# Altium schematic sheet Register.SchDoc
size B; Author: E. Sims; Organization: Let's Build Rockets Inc.; SheetNumber: 1; SheetTotal: 3
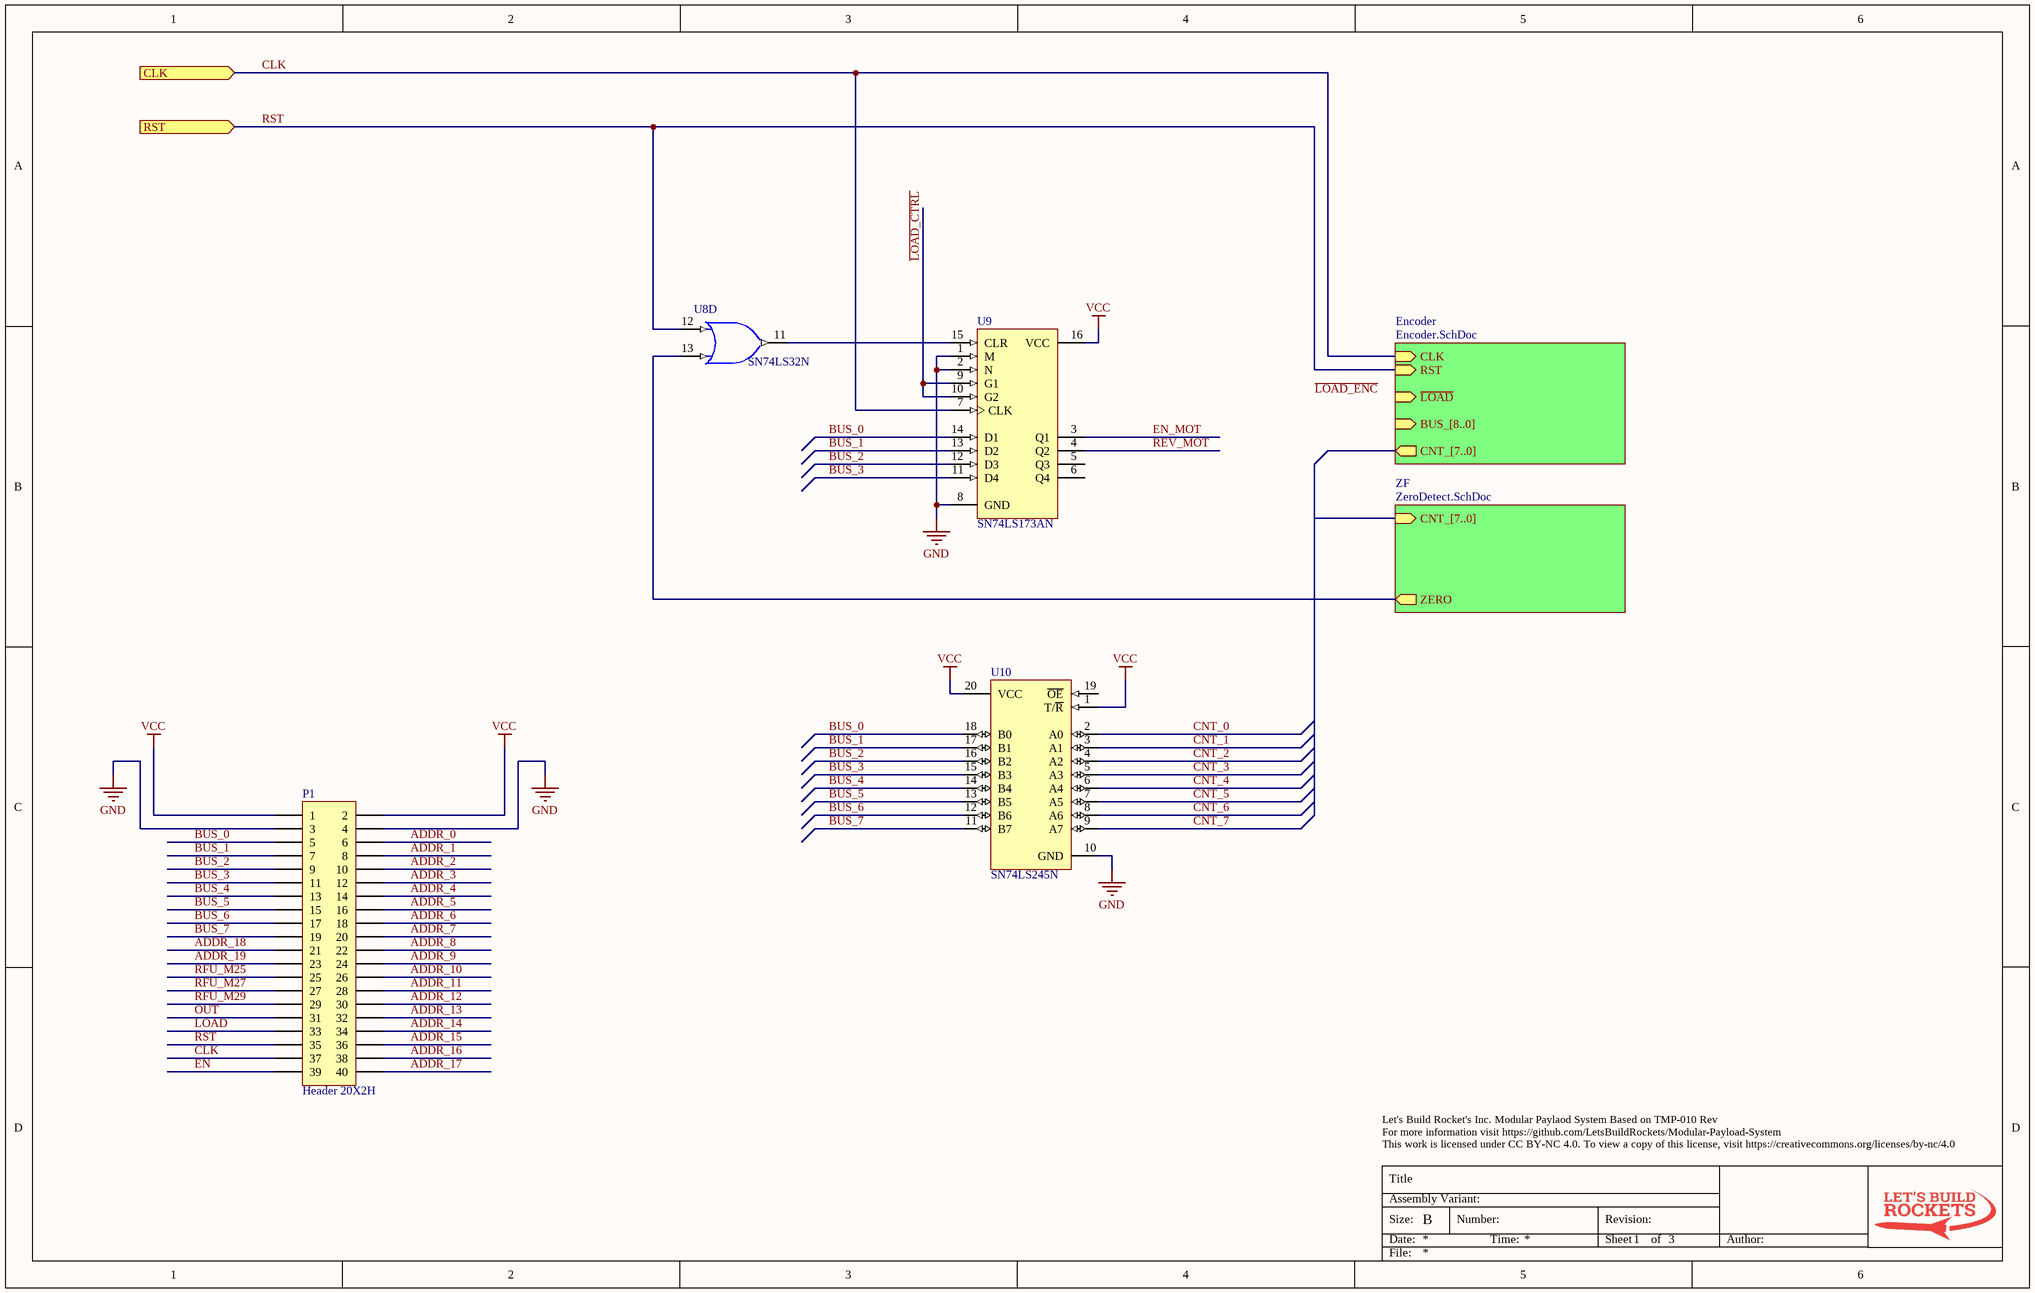
[diagram p0: Register.SchDoc]

## Parts
P1  Header 20X2H  [HDR2X20H]
U8  SN74LS32N  [N014]  (part D of 4)
U9  SN74LS173AN  [N016D]
U10  SN74LS245N  [N020]

## Sub-sheets
Encoder = Encoder.SchDoc: CNT_[7..0] (out), CLK (in), RST (in), BUS_[8..0] (in), ~{LOAD} (in)
ZF = ZeroDetect.SchDoc: CNT_[7..0] (in), ZERO (out)

## Ports
CLK (in), RST (in)

## Nets
GND: P1.3 P1.4 U8.7(GND) U9.1(M) U9.2(N) U9.8(GND) U10.10(GND)
VCC: P1.1 P1.2 U8.14(VCC) U9.16(VCC) U10.1(T/~{R}) U10.20(VCC)
ADDR_0: P1.6
ADDR_1: P1.8
ADDR_2: P1.10
ADDR_3: P1.12
ADDR_4: P1.14
ADDR_5: P1.16
ADDR_6: P1.18
ADDR_7: P1.20
ADDR_8: P1.22
ADDR_9: P1.24
ADDR_10: P1.26
ADDR_11: P1.28
ADDR_12: P1.30
ADDR_13: P1.32
ADDR_14: P1.34
ADDR_15: P1.36
ADDR_16: P1.38
ADDR_17: P1.40
ADDR_18: P1.21
ADDR_19: P1.23
BUS_0: P1.5 U9.14(D1) U10.18(B0)
BUS_1: P1.7 U9.13(D2) U10.17(B1)
BUS_2: P1.9 U9.12(D3) U10.16(B2)
BUS_3: P1.11 U9.11(D4) U10.15(B3)
BUS_4: P1.13 U10.14(B4)
BUS_5: P1.15 U10.13(B5)
BUS_6: P1.17 U10.12(B6)
BUS_7: P1.19 U10.11(B7)
CLK: P1.37 U9.7(CLK) ; port CLK, sheet Encoder/CLK
CNT_0: U10.2(A0)
CNT_1: U10.3(A1)
CNT_2: U10.4(A2)
CNT_3: U10.5(A3)
CNT_4: U10.6(A4)
CNT_5: U10.7(A5)
CNT_6: U10.8(A6)
CNT_7: U10.9(A7)
EN: P1.39
EN_MOT: U9.3(Q1)
~{LOAD_CTRL}: U9.9(G1) U9.10(G2)
LOAD: P1.33
~{OUT}: P1.31
REV_MOT: U9.4(Q2)
RFU_M25: P1.25
RFU_M27: P1.27
RFU_M29: P1.29
RST: P1.35 U8.12(A) ; port RST, sheet Encoder/RST
NetU8_11: U8.11(Y) U9.15(CLR)
NetU8_13: U8.13(B) ; sheet ZF/ZERO

Not connected (* = marked no-connect by the designer): U9 5(Q3) 6(Q4); U10 19(~{OE})

## Buses and harness runs
bus sheet Encoder/CNT_[7..0] = sheet ZF/CNT_[7..0]

## Notes on the sheet
- Labels drawn without touching a wire or pin: ~{LOAD_ENC}
- Let's Build Rocket's Inc. Modular Paylaod System Based on TMP-010 Rev
  For more information visit https://github.com/LetsBuildRockets/Modular-Payload-System
  This work is licensed under CC BY-NC 4.0. To view a copy of this license, visit https://creativecommons.org/licenses/by-nc/4.0
- Title
- Size:
- Date:
- Assembly Variant:
- B
- Number:
- Time:
- Revision:
- Sheet
- of
- Author:
- File:

## Library data of the parts
P1 = Header 20x2H: Header, 20-Pin, Dual row, Right Angle; LatestRevisionDate: 17-Jul-2002; LatestRevisionNote: Re-released for DXP Platform.; Publisher: Altium Limited
U8 = SN74LS32N: Quadruple 2-Input Positive-OR Gate; Published: 8-Jun-2000; LatestRevisionDate: 04-Mar-2005; LatestRevisionNote: Stylized 3D Model Added.; DatasheetVersion: Mar-1988; PackageVersion: Oct-1995; PackageReference: N014; Publisher: Altium Limited; PackageDescription: DIP; 14 Leads; Row Spacing 7.62 mm; Pitch 2.54 mm; ComponentLink1Description: Manufacturer Link; ComponentLink1URL: http://www.ti.com/; ComponentLink2Description: Datasheet; ComponentLink2URL: http://www-s.ti.com/sc/ds/sn74ls32.pdf
U9 = SN74LS173AN: 4-Bit D-Type Register with 3-State Outputs; Published: 8-Jun-2000; LatestRevisionDate: 04-Mar-2005; LatestRevisionNote: Stylized 3D Model Added.; DatasheetVersion: Mar-1988; PackageVersion: Oct-1995; PackageReference: N016D; Publisher: Altium Limited; PackageDescription: DIP; 16 Leads; Row Spacing 7.62 mm; Pitch 2.54 mm; Code_JEDEC: MS-001-BB; ComponentLink1Description: Manufacturer Link; ComponentLink1URL: http://www.ti.com/; ComponentLink2Description: Datasheet; ComponentLink2URL: http://www-s.ti.com/sc/ds/sn74ls173a.pdf
U10 = SN74LS245N: Octal Bus Transceiver with 3-State Outputs; Published: 8-Jun-2000; LatestRevisionDate: 04-Mar-2005; LatestRevisionNote: Stylized 3D Model Added.; DatasheetVersion: Mar-1988; PackageVersion: Oct-1995; PackageReference: N020; Publisher: Altium Limited; PackageDescription: DIP; 20 Leads; Row Spacing 7.62 mm; Pitch 2.54 mm; ComponentLink1Description: Manufacturer Link; ComponentLink1URL: http://www.ti.com/; ComponentLink2Description: Datasheet; ComponentLink2URL: http://www-s.ti.com/sc/ds/sn74ls245.pdf